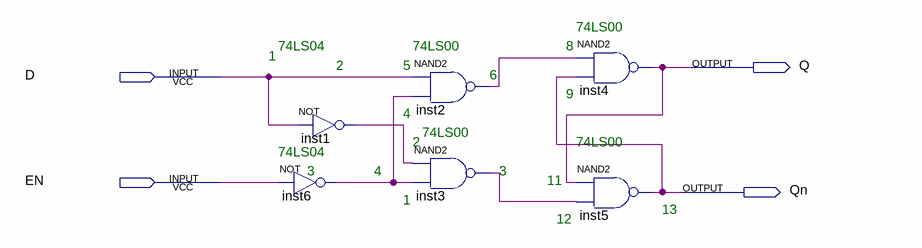
[diagram p0: schematic sheet]
// Quartus schematic Lab7.bdf as structural Verilog: 6 symbols, 4 pins
module Lab7 (
  input  D,
  input  EN,
  output Q,
  output Qn
);

  wire inst1_out, inst2_out, inst3_out, inst6_out;

  not inst1 (inst1_out, D);
  not inst6 (inst6_out, EN);
  nand inst2 (inst2_out, D, inst6_out);
  nand inst3 (inst3_out, inst1_out, inst6_out);
  nand inst4 (Q, inst2_out, Qn);
  nand inst5 (Qn, Q, inst3_out);

  // Notes on the sheet:
  //   74LS00
  //   74LS04
  //   74LS00
  //   8
  //   1
  //   2
  //   5
  //   6
  //   9
  //   4
  //   74LS00
  //   2
  //   74LS00
  //   74LS04
  //   3
  //   4
  //   3
  //   11
  //   1
  //   13
  //   12
endmodule
